# Altium schematic sheet SME_MP2759GQ_PowerPath.SchDoc: Titulo
size OrCAD A; Author: Ismael Poblete V.; CompanyName: SME; Organization: SME; Address1: Santiago, Chile; DocumentNumber: SME-UNO; Revision: 1.0; SheetNumber: 7; SheetTotal: 7
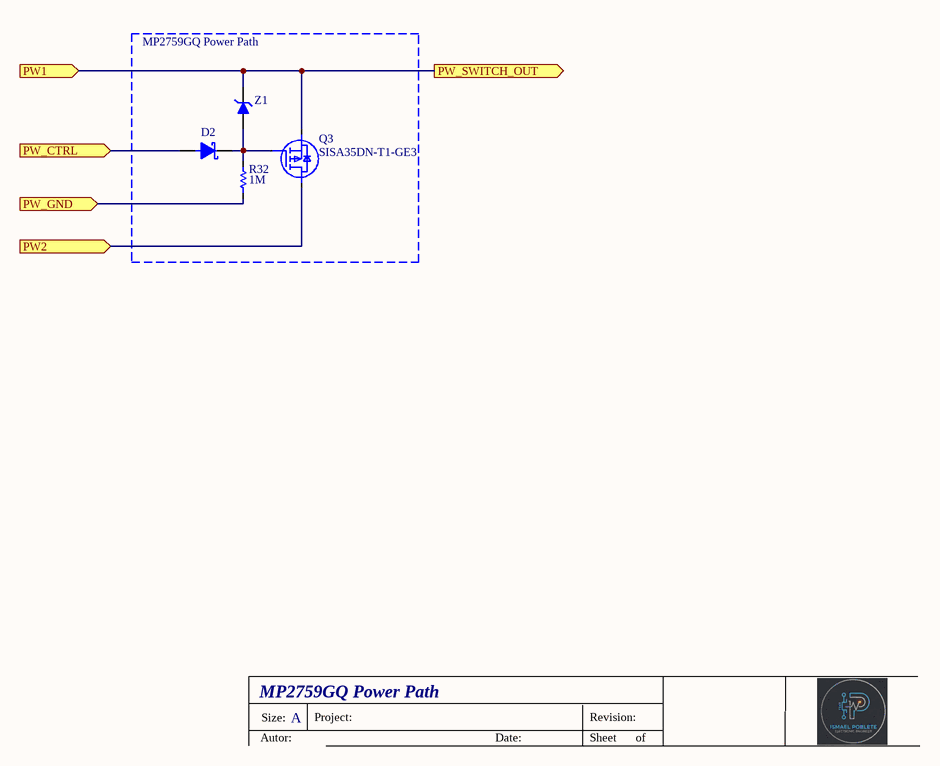
[diagram p0: SME_MP2759GQ_PowerPath.SchDoc]

## Parts
D2  CDBB240-HF  [DO-214AA-2]  (value not drawn)
Q3  SISA35DN-T1-GE3  [PowerPAK 1212-8-Pad]
R32  Resistance: 1M  [RES_0603]  (hidden comment: RT0603FRE071ML)
Z1  SZNZ8P12VMX2WT5G  [SOD-923]  (value not drawn)

## Blocks framed on the sheet
MP2759GQ Power Path: D2 Q3 R32 Z1

## Ports
PW1 (in, see SME_Main[2B]), PW2 (in, see SME_Main[2B]), PW_CTRL (in, see SME_Main[2B]), PW_GND (in, see SME_Main[2B]), PW_SWITCH_OUT (out, see SME_Main[2B])

## Nets
PW1: Q3.1(S) Z1.1(K) ; port PW_SWITCH_OUT, port PW1
PW2: Q3.3(D) ; port PW2
PW_CTRL: D2.1(A) ; port PW_CTRL
PW_GND: R32.1 ; port PW_GND
NetD2_2: D2.2(K) Q3.2(G) R32.2 Z1.2(A)

## Notes on the sheet
- MP2759GQ Power Path
- Size:
- A
- Project:
- Revision:
- Autor:
- Date:
- Sheet
- of

## Library data of the parts
D2 = CDBB240-HF: Schottky Diode; Manufacturer_Name: Comchip Technology; Datasheet Link: https://datasheet.datasheetarchive.com/originals/distributors/DKDS41/DSANUWW0021461.pdf; Height: 3.2mm; Manufacturer_Part_Number: CDBB240-HF; Mouser Part Number: 750-CDBB240-HF; Mouser Price/Stock: https://www.mouser.co.uk/ProductDetail/Comchip-Technology/CDBB240-HF?qs=%252BiOMRfgENTHvuVH5OF%252BwbA%3D%3D; Arrow Part Number: CDBB240-HF; Arrow Price/Stock: https://www.arrow.com/en/products/cdbb240-hf/comchip-technology?region=nac
Q3 = SISA35DN-T1-GE3: MOSFET P-CHANNEL 30-V (D-S) PowerPAK 1212-8; Manufacturer_Name: Vishay; Geometry.Height: 1.17mm; Mouser Part Number: 78-SISA35DN-T1-GE3; Mouser Price/Stock: https://www.mouser.co.uk/ProductDetail/Vishay-Semiconductors/SISA35DN-T1-GE3?qs=xZ%2FP%252Ba9zWqbzg0tXMvfS4g%3D%3D; Manufacturer_Part_Number: SISA35DN-T1-GE3; Datasheet Link: https://www.vishay.com/docs/75831/sisa35dn.pdf
R32 = RT0603FRE071ML: Thin Film Resistors - SMD 1M OHM 1% 50PPM 1/10 W; Case/Package: 0603
Z1 = SZNZ8P12VMX2WT5G: Zener Diode; Manufacturer_Name: onsemi; Datasheet Link: https://www.onsemi.com/pub/Collateral/NZ8PMX2-D.PDF; Height: 0.4mm; Manufacturer_Part_Number: SZNZ8P12VMX2WT5G